# EAGLE design OperantFED (EAGLE 7.7.0)
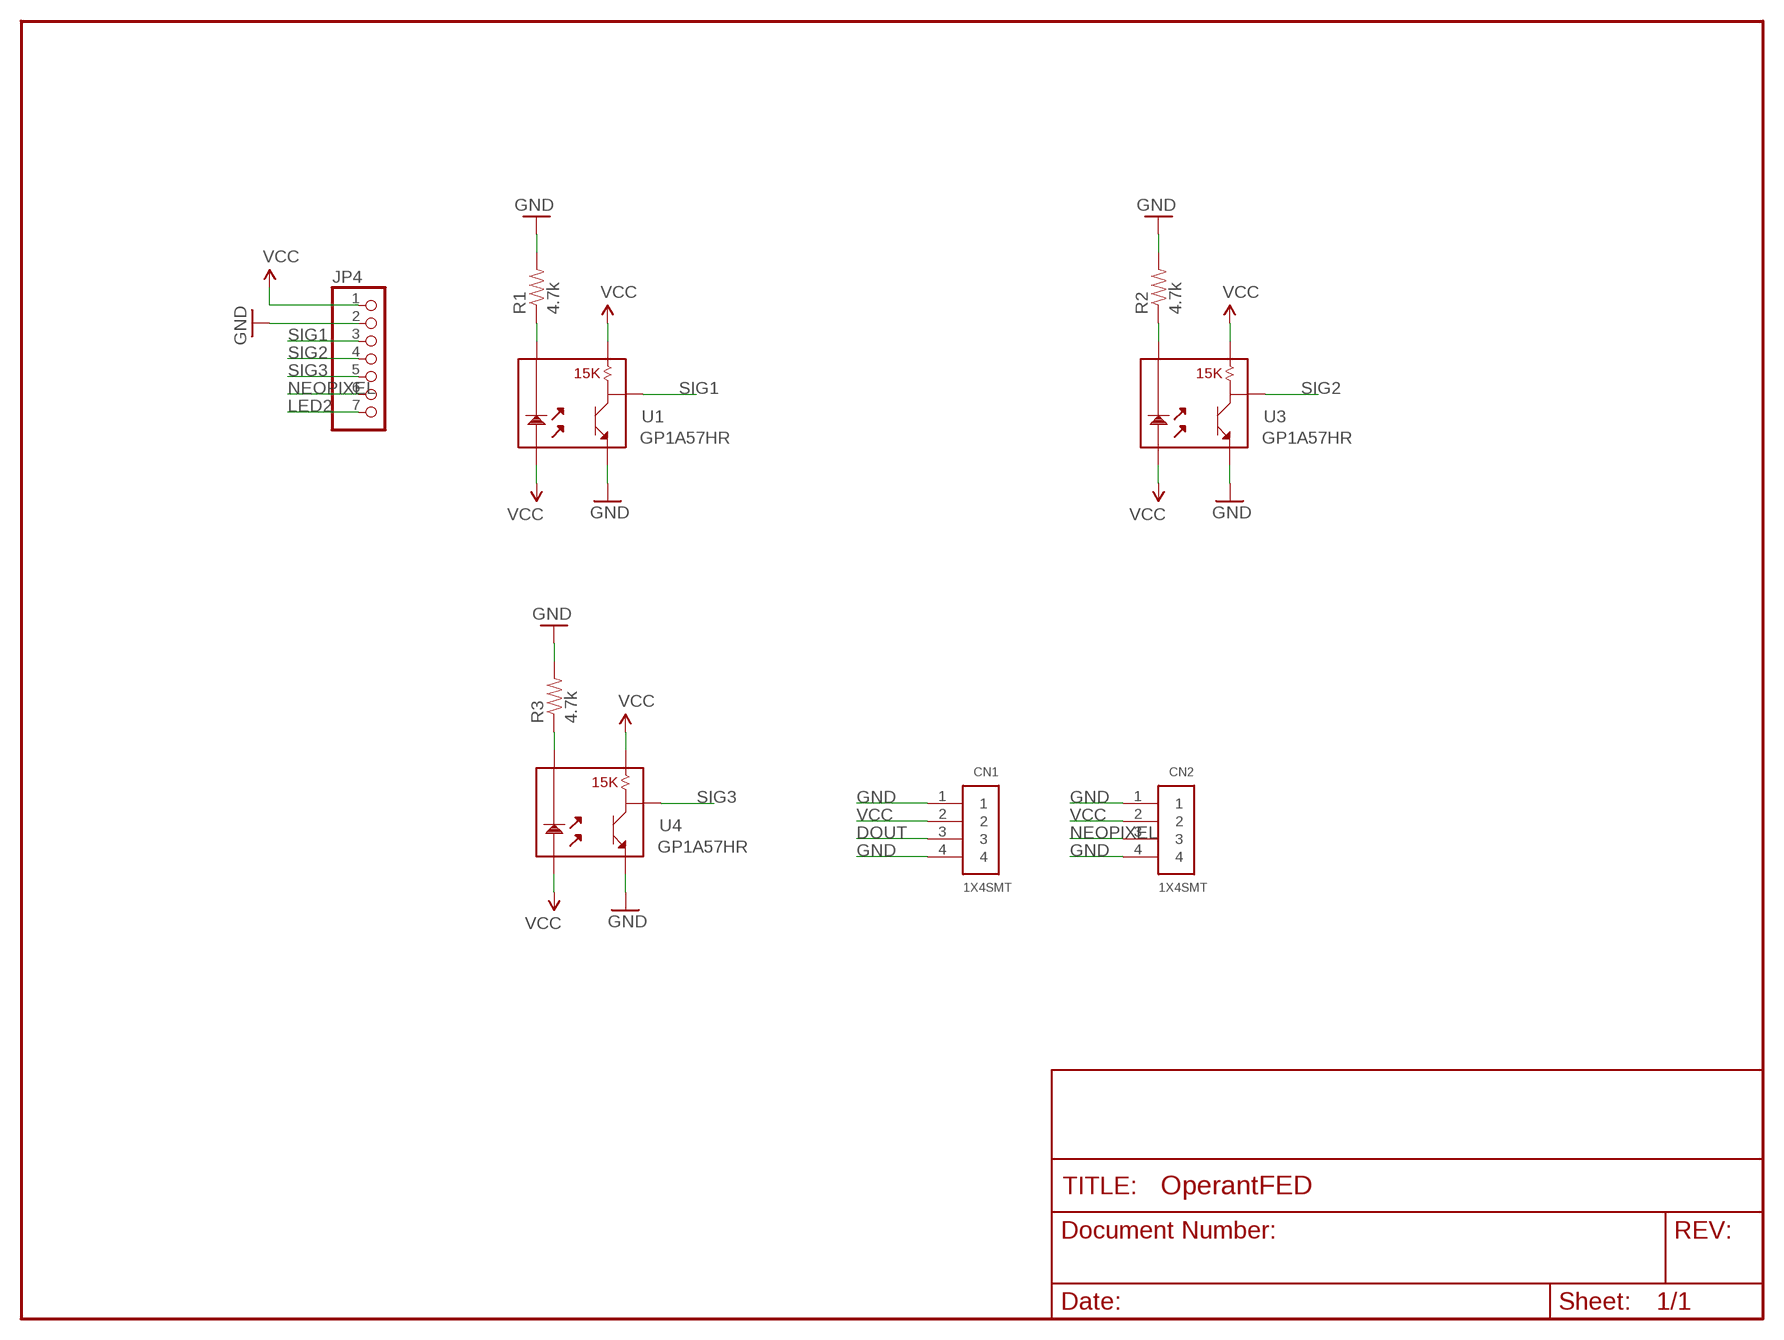
[diagram p0: schematic, sheet 1]

## Parts
CN1  1X4SMT  [1X4-SMT]
CN2  1X4SMT  [1X4-SMT]
JP4  PINHD-1X7  [1X07]
R1  4.7k  RESISTORPTH1  [AXIAL-0.3]
R2  4.7k  RESISTORPTH1  [AXIAL-0.3]
R3  4.7k  RESISTORPTH1  [AXIAL-0.3]
U1  GP1A57HR  [GP1A57HR]
U3  GP1A57HR  [GP1A57HR]
U4  GP1A57HR  [GP1A57HR]

## Nets
DOUT: CN1.3
GND: CN1.1 CN1.4 CN2.1 CN2.4 JP4.2 R1.P$2 R2.P$2 R3.P$2 U1.5 U3.5 U4.5
LED2: JP4.7
N$1: R2.P$1 U3.2
N$2: R1.P$1 U1.2
N$3: R3.P$1 U4.2
NEOPIXEL: CN2.3 JP4.6
SIG1: JP4.3 U1.4
SIG2: JP4.4 U3.4
SIG3: JP4.5 U4.4
VCC: CN1.2 CN2.2 JP4.1 U1.1 U1.3 U3.1 U3.3 U4.1 U4.3

## Library data of the parts
CN1 CN2 = adafruit:1X4: 4-pin connector
JP4 = pinhead:PINHD-1X7: PIN HEADER
R1-R3 = SparkFun:RESISTOR: Resistor Basic schematic elements and footprints for 0603, 1206, and PTH 1/10th watt (small) resistors.
U1 U3 U4 = SparkFun:GP1A57HR

## Board
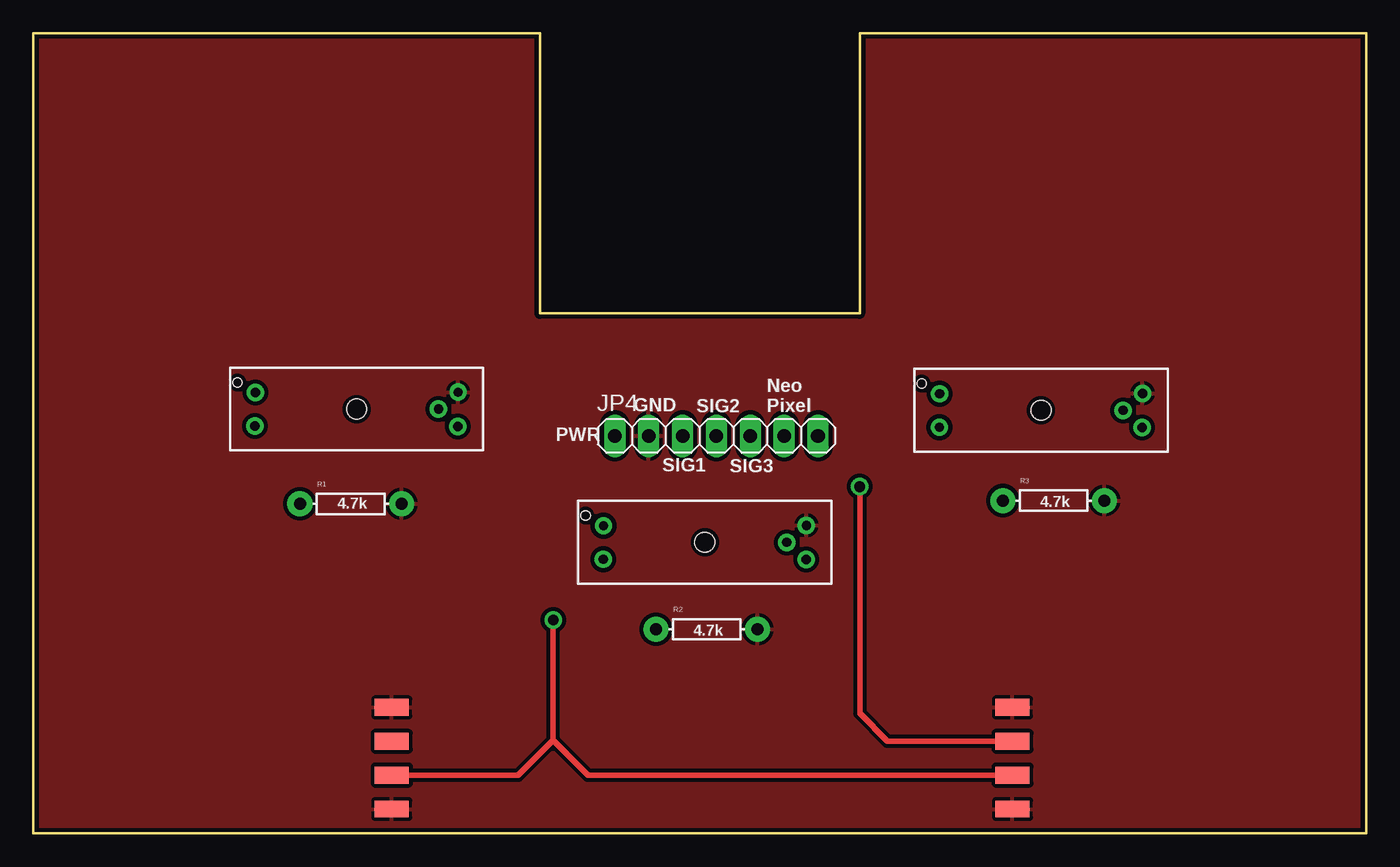
[diagram p1: board, top side]
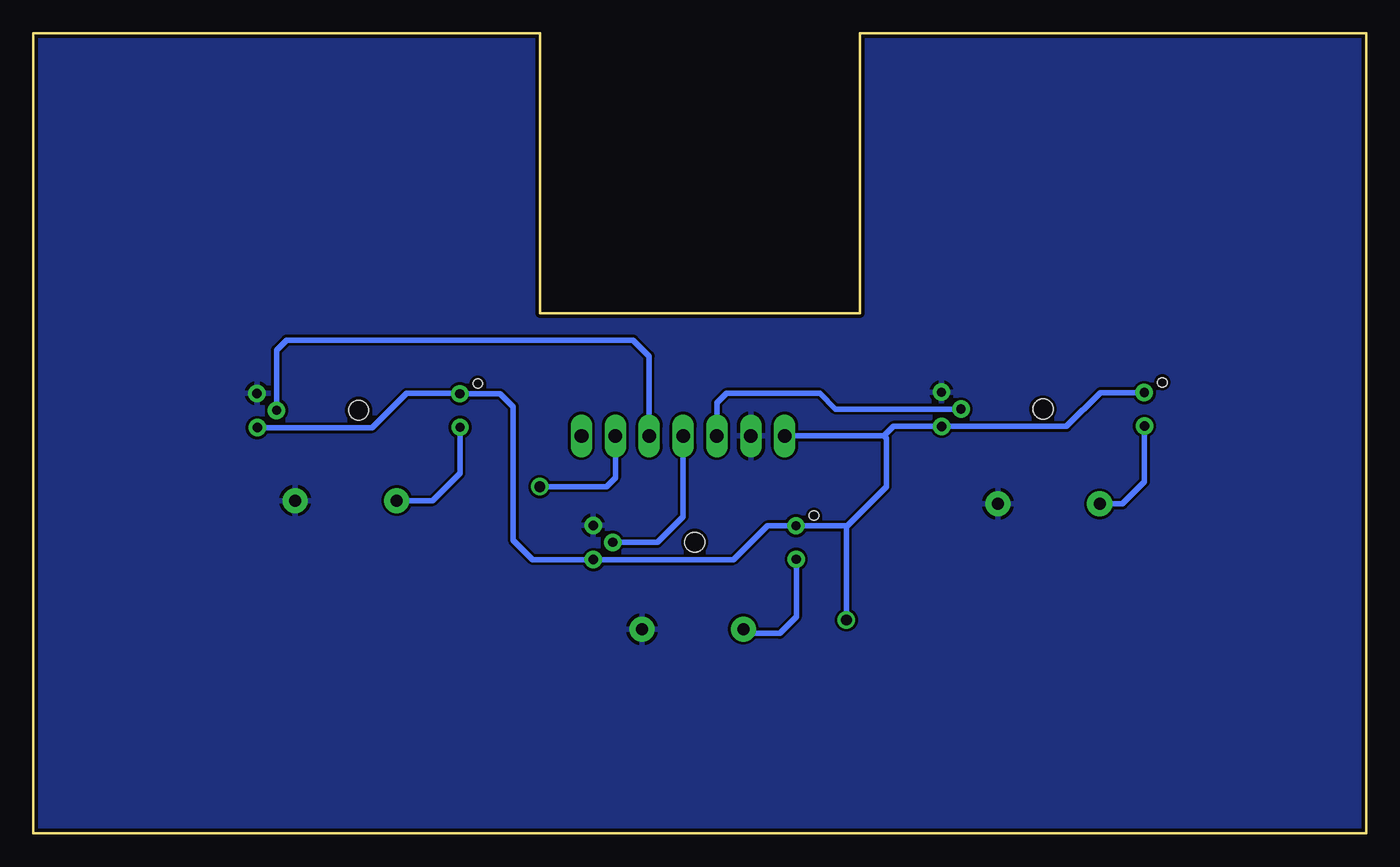
[diagram p2: board, bottom side, seen from below]

Size 100 x 60 mm. Coordinates in mm from the lower left corner, seen from the top.
Outline: 0,0 100,0 100,60 62,60 62,39 38,39 38,60 0,60 0,0
Copper layers (1*16): Top 0.0356mm / dielectric 1.5011mm / Bottom 0.0356mm
Design rules "default": minimum track width 8mil, minimum drill 20mil, track to track 8mil, track to pad 8mil, pad to pad 8mil, via to via 8mil, smd to smd 8mil, copper to edge 10mil, drill to drill 8mil, minimum pad ring 12mil, minimum via ring 10mil, stop-mask expansion 4mil, vias tented up to drill 20mil, thermal gap 10mil

### Footprints (pad centres in the part's own frame; a part is rotated, then mirrored left to right if it is on the bottom)
1X4-SMT = smd 1.27 x 2.54: 1 -3.81,0; 2 -1.27,0; 3 1.27,0; 4 3.81,0
1X07 = drill 1.016 long: 1 -7.62,0; 2 -5.08,0; 3 -2.54,0; 4 0,0; 5 2.54,0; 6 5.08,0; 7 7.62,0
AXIAL-0.3 = drill 0.9 pad 1.88: P$1 -3.81,0; P$2 3.81,0
GP1A57HR = drill 0.7: 1 -7.6,1.24; 2 -7.62,-1.27; 3 7.6,-1.3; 4 6.15,0; 5 7.62,1.27 | hole 1.5: 0,0 | hole 0.7: -8.95,2

### Placement (x,y rotation side)
CN1  26.89,5.63 90 top
CN2  73.46,5.63 90 top
JP4  51.25,29.81 0 top
R1  23.81,24.71 0 top
R2  50.53,15.31 0 top
R3  76.55,24.96 0 top
U1  24.25,31.82 0 top
U3  50.38,21.83 0 top
U4  75.6,31.73 0 top

### Tracks (layer width: path | path; a pad name or v marks a point on that pad's centre or on a via)
GND
  pour Top (isolate 0.305): -3,-2.93 101.74,-2.93 101.74,66.1 -3,66.1
  pour Bottom: -4.97,66.97 -4.97,-5.05 103.44,-4.95 103.44,67.07
N$1
  Bottom 0.406: U3.2 42.76,16.24 44,15 46.41,15 R2.P$1
N$2
  Bottom 0.406: U1.2 16.63,26.37 18.29,24.71 R1.P$1
N$3
  Bottom 0.406: R3.P$1 70.04,24.96 68,27 68,30.44 U4.2
NEOPIXEL  (via drill 0.8)
  Top 0.406: v62,26 62,9 64.09,6.91 CN2.3
  Bottom 0.406: JP4.6 56.33,26.67 57,26 v62,26
SIG1
  Bottom 0.406: U1.4 39.82,31.82 41,33 48,33 48.71,32.29 JP4.3
SIG2
  Bottom 0.406: U3.4 53.17,21.83 51.25,23.75 JP4.4
SIG3
  Bottom 0.406: JP4.5 53.79,35.79 55,37 81,37 81.75,36.25 U4.4
VCC  (via drill 0.8)
  Top 0.406: 39,7 36.37,4.37 CN1.2 | 39,7 v39,16 | 39,7 41.63,4.37 CN2.2
  Bottom 0.406: JP4.1 36.19,29.81 | 39,23.07 U3.1 44.93,23.07 47.47,20.53 U3.3 62.53,20.53 64,22 64,32 64.97,32.97 U4.1 68.03,33 72,33 74.57,30.43 U4.3 | 39,23.07 38.93,23.07 36,26 36,29.61 36.19,29.81 | v39,16 39,23.07 | 36.19,29.81 35.48,30.52 U1.3 22.48,30.52 19.94,33.06 U1.1

### Text on the board
tPlace: GND | SIG2 | Neo / Pixel | PWR | SIG1 | SIG3